# EAGLE design AmplifierPowerSupply (EAGLE 9.4.2)
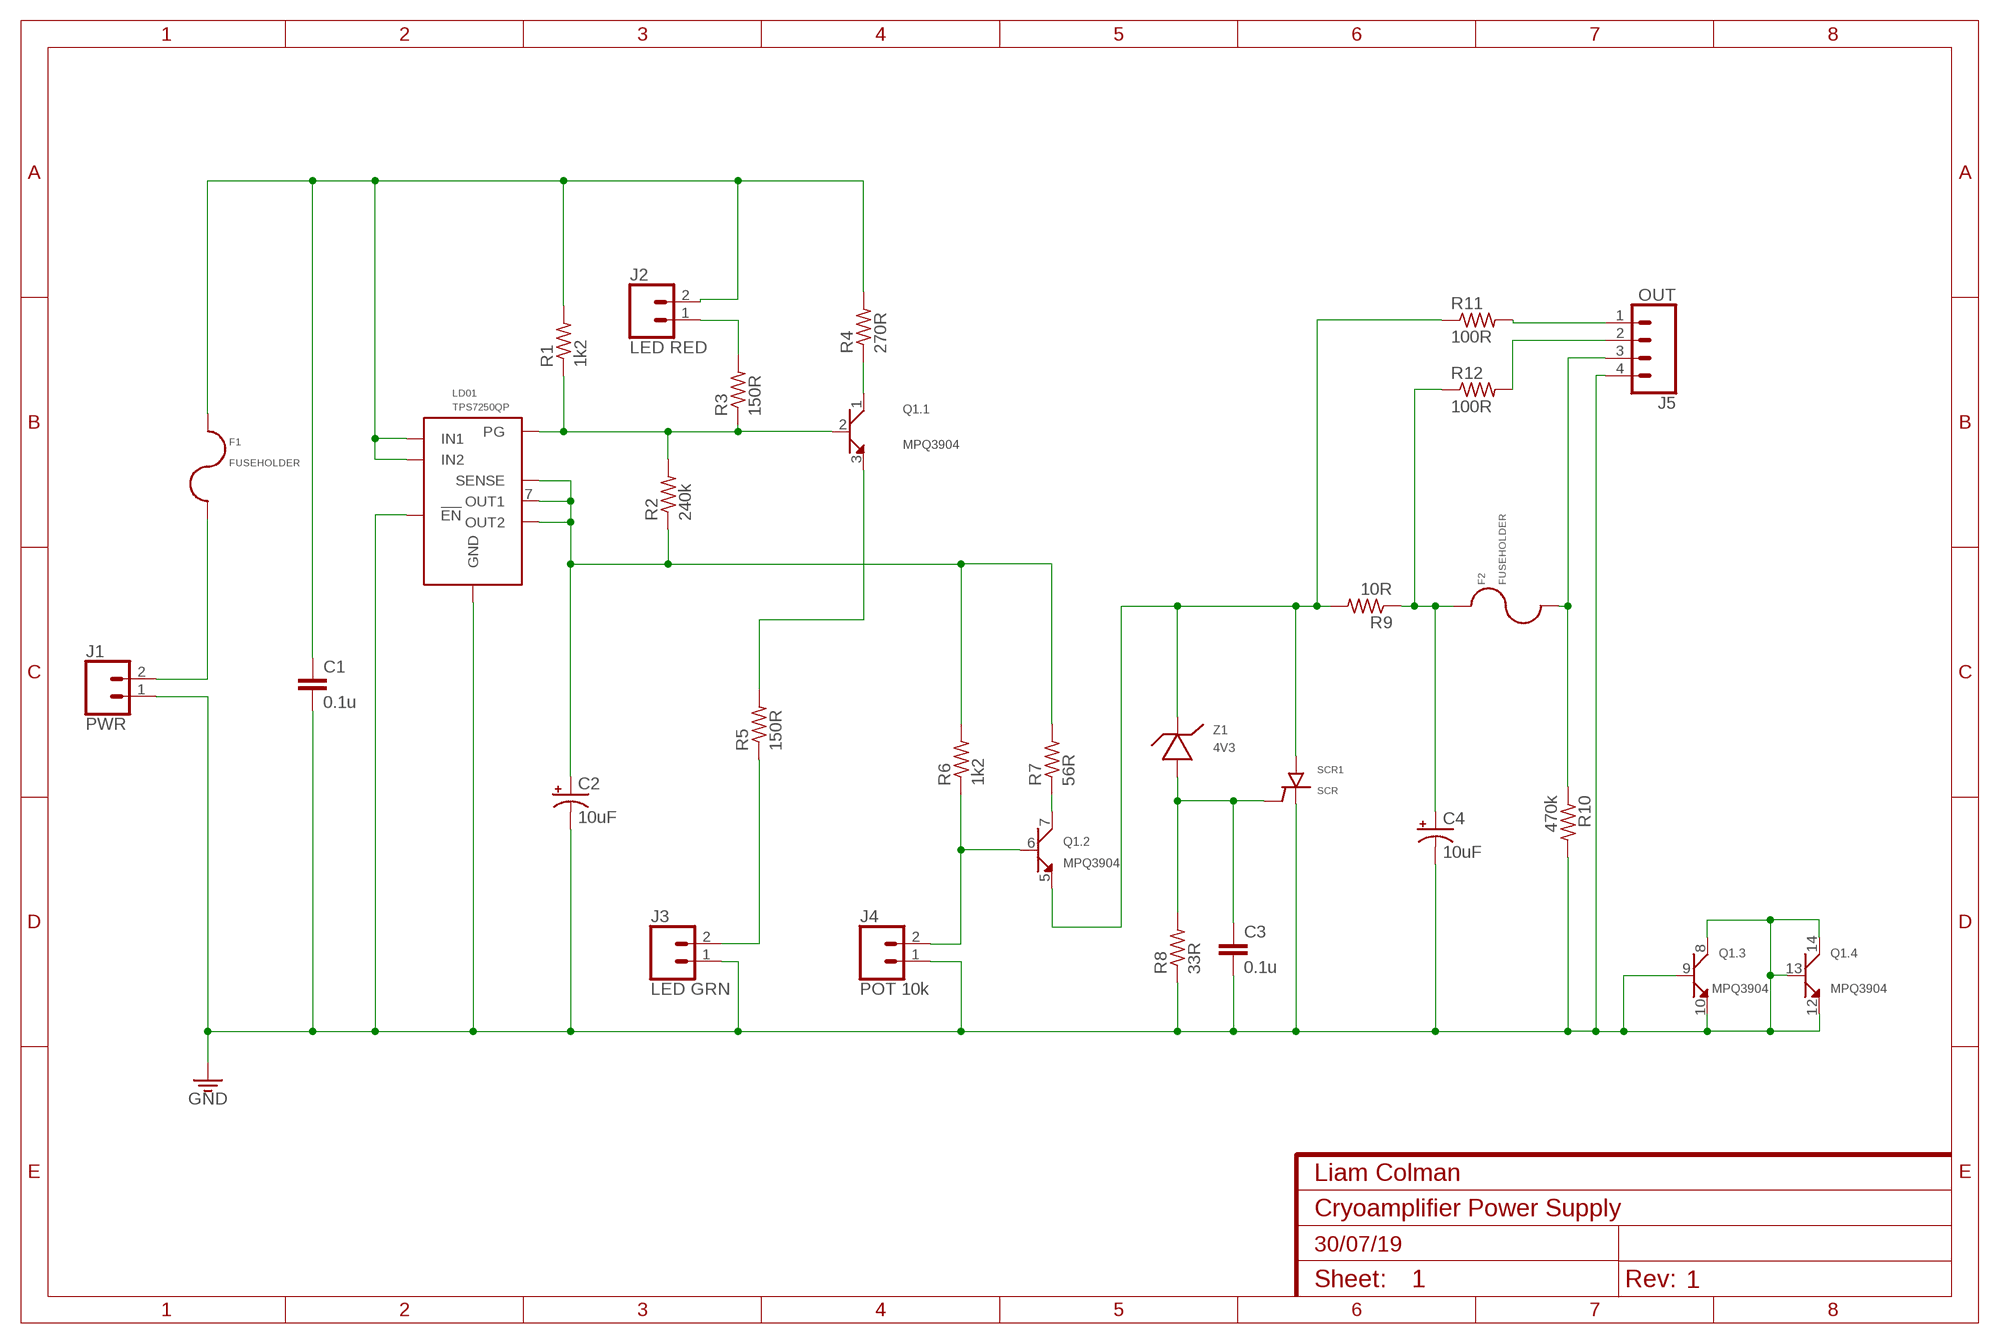
[diagram p0: schematic, sheet 1]

## Parts
C1  0.1u  C-EUC1206K  [C1206K]
C2  10uF  10UF-POLAR-EIA3216-16V-10%(TANT)  [EIA3216]
C3  0.1u  C-EUC1206K  [C1206K]
C4  10uF  10UF-POLAR-EIA3216-16V-10%(TANT)  [EIA3216]
F1  FUSEHOLDER  [FUSEHOLDER]
F2  FUSEHOLDER  [FUSEHOLDER]
FRAME1  FRAMELIAM-A4  [DUMMY]
J1  PWR  CONN_02  [1X02]
J2  LED RED  CONN_02  [1X02]
J3  LED GRN  CONN_02  [1X02]
J4  POT 10k  CONN_02  [1X02]
J5  OUT  CONN_04PTH  [1X04]
LD01  TPS7250QP  LD01  [TPS7250QP]
Q1  MPQ3904  [MPQ3904]
R1  1k2  R-US_R0805  [R0805]
R2  240k  R-US_R0805  [R0805]
R3  150R  R-US_R0805  [R0805]
R4  270R  R-US_R0805  [R0805]
R5  150R  R-US_R0805  [R0805]
R6  1k2  R-US_R0805  [R0805]
R7  56R  R-US_R0805  [R0805]
R8  33R  R-US_R0805  [R0805]
R9  10R  R-US_R0805  [R0805]
R10  470k  R-US_R0805  [R0805]
R11  100R  R-US_R0805  [R0805]
R12  100R  R-US_R0805  [R0805]
SCR1  SCR  [TO-92]
Z1  4V3  ZENERDIODESMD  [DZ2W04300L]

## Nets
GND: C1.2 C2.- C3.2 C4.- J1.1 J3.1 J4.1 J5.4 LD01.3(GND) LD01.4(!EN!) Q1.8(.3:COLLECTOR) Q1.9(.3:BASE) Q1.10(.3:EMITTER) Q1.12(.4:EMITTER) Q1.13(.4:BASE) Q1.14(.4:COLLECTOR) R8.1 R10.2 SCR1.K(CATHODE)
N$1: F1.P$2 J1.2
N$2: C1.1 F1.P$1 J2.2 LD01.5(IN1) LD01.6(IN2) R1.2 R4.2
N$3: J2.1 R3.2
N$4: LD01.2(PG) Q1.2(.1:BASE) R1.1 R2.2 R3.1
N$5: J5.1 R11.2
N$6: J5.2 R12.2
N$7: C4.+ F2.P$1 R9.1 R12.1
N$8: F2.P$2 J5.3 R10.1
N$9: J4.2 Q1.6(.2:BASE) R6.1
N$10: Q1.1(.1:COLLECTOR) R4.1
N$11: Q1.3(.1:EMITTER) R5.2
N$12: J3.2 R5.1
N$13: Q1.7(.2:COLLECTOR) R7.1
N$14: Q1.5(.2:EMITTER) R9.2 R11.1 SCR1.A(ANODE) Z1.1(CATHODE)
N$15: C2.+ LD01.1(SENSE) LD01.7(OUT1) LD01.8(OUT2) R2.1 R6.2 R7.2
N$16: C3.1 R8.2 SCR1.G(GATE) Z1.2(ANODE)

## Library data of the parts
C1 C3 = resistor:C-EU: CAPACITOR, European symbol
C2 C4 = SparkFun-Capacitors:10UF-POLAR: 10.0µF polarized capacitors A capacitor is a passive two-terminal electrical component used to store electrical energy temporarily in an electric field.; PROD_ID: CAP-00811
F1 F2 = RequiredComponents:FUSEHOLDER: Description This is the HTC-100M Fuseholder, which holds a 5x20mm fuse. It is rated at 250V and 5A, and has a pitch of 22.6mm.
FRAME1 = SparkFun-Aesthetics:FRAMELIAM-A4: Schematic Frame - A4L - European Format Standard A4 size frame in Landscape
J1-J4 = SparkFun-Connectors:CONN_02: Multi connection point. Often used as Generic Header-pin footprint for 0.1 inch spaced/style header connections On any of the 0.1 inch spaced packages, you can populate with these: Break Away Headers - Straight <https://www.sparkfun.com/products/116> (PRT-00116) Break Away Male Headers - Right Angle <https://www.sparkfun.com/products/553> (PRT-00553) Female Headers <https://www.sparkfun.com/products/115> (PRT-00115) Break Away Headers - Machine Pin <https://www.sparkfun.com/products/117> (PRT-00117) Break Away Female Headers - Swiss Machine Pin <https://www.sparkfun.com/products/743> (PRT-00743) For SCREWTERMINALS and SPRING TERMINALS visit here: Screw Terimnals on SparkFun.com <https://www.sparkfun.com/search/results?term=Screw+Terminals> (5mm/3.5mm/2.54mm spacing) This device is also useful as a general connection point to wire up your design to another part of your project. Our various solder wires solder well into these plated through hole pads. Hook-Up Wire - Assortment (Stranded, 22 AWG) <https://www.sparkfun.com/products/11375> (PRT-11375) Hook-Up Wire - Assortment (Solid Core, 22 AWG) <https://www.sparkfun.com/products/11367> (PRT-11367) View the entire wire category on our website here <https://www.sparkfun.com/categories/141> Special notes: Molex polarized connector foot print use with: PRT-08233 with associated crimp pins and housings. 2.54_SCREWTERM for use with PRT-10571. 3.5mm Screw Terminal footprints for PRT-08084 5mm Screw Terminal footprints for use with PRT-08432
J5 = SparkFun-Connectors:CONN_04: Multi connection point. Often used as Generic Header-pin footprint for 0.1 inch spaced/style header connections On any of the 0.1 inch spaced packages, you can populate with these: Break Away Headers - Straight <https://www.sparkfun.com/products/116> (PRT-00116) Break Away Male Headers - Right Angle <https://www.sparkfun.com/products/553> (PRT-00553) Female Headers <https://www.sparkfun.com/products/115> (PRT-00115) Break Away Headers - Machine Pin <https://www.sparkfun.com/products/117> (PRT-00117) Break Away Female Headers - Swiss Machine Pin <https://www.sparkfun.com/products/743> (PRT-00743) For SCREWTERMINALS and SPRING TERMINALS visit here: Screw Terimnals on SparkFun.com <https://www.sparkfun.com/search/results?term=Screw+Terminals> (5mm/3.5mm/2.54mm spacing) This device is also useful as a general connection point to wire up your design to another part of your project. Our various solder wires solder well into these plated through hole pads. Hook-Up Wire - Assortment (Stranded, 22 AWG) <https://www.sparkfun.com/products/11375> (PRT-11375) Hook-Up Wire - Assortment (Solid Core, 22 AWG) <https://www.sparkfun.com/products/11367> (PRT-11367) View the entire wire category on our website here <https://www.sparkfun.com/categories/141> Special notes: Molex polarized connector foot print use with SKU : PRT-08231 with associated crimp pins and housings. 1MM SMD Version SKU: PRT-10208; PROD_ID: CONN-09696
LD01 = RequiredComponents:LD01: Description This is a micro power low-dropout voltage regulator, which also has a power-good output, and extremely low quiescent currents.
Q1 = RequiredComponents:MPQ3904: Description This is a quad polar transistor configuration inside of a TO-116 package.
R1-R12 = resistor:R-US_: RESISTOR, American symbol
SCR1 = RequiredComponents:SCR: Description This is a sensitive gate SCR, which will short itself if the voltage in the circuit exceeds a certain value. Useful for circuit protection
Z1 = RequiredComponents:ZENERDIODE

## Board
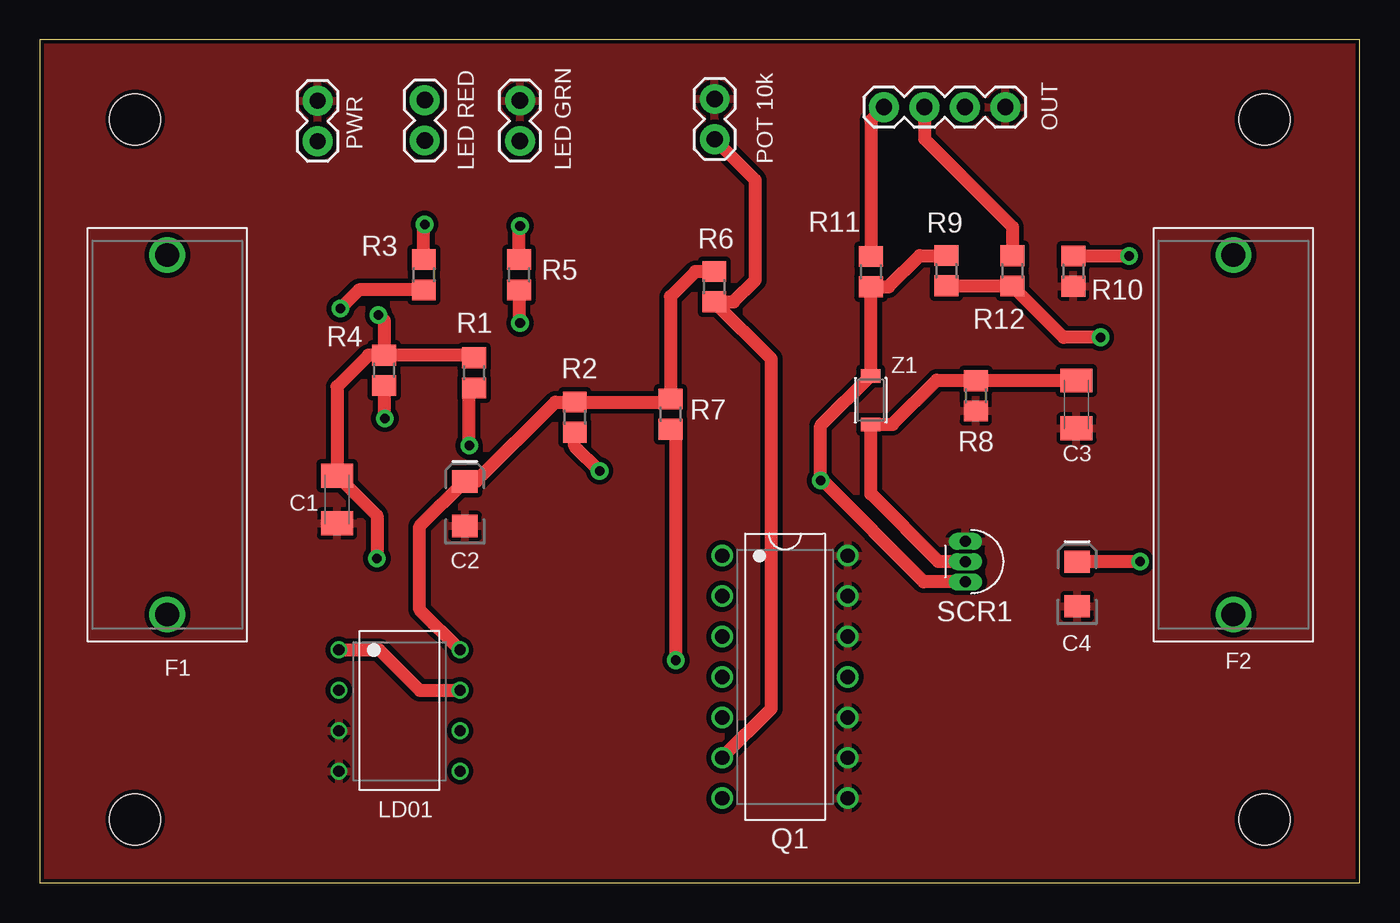
[diagram p1: board, top side]
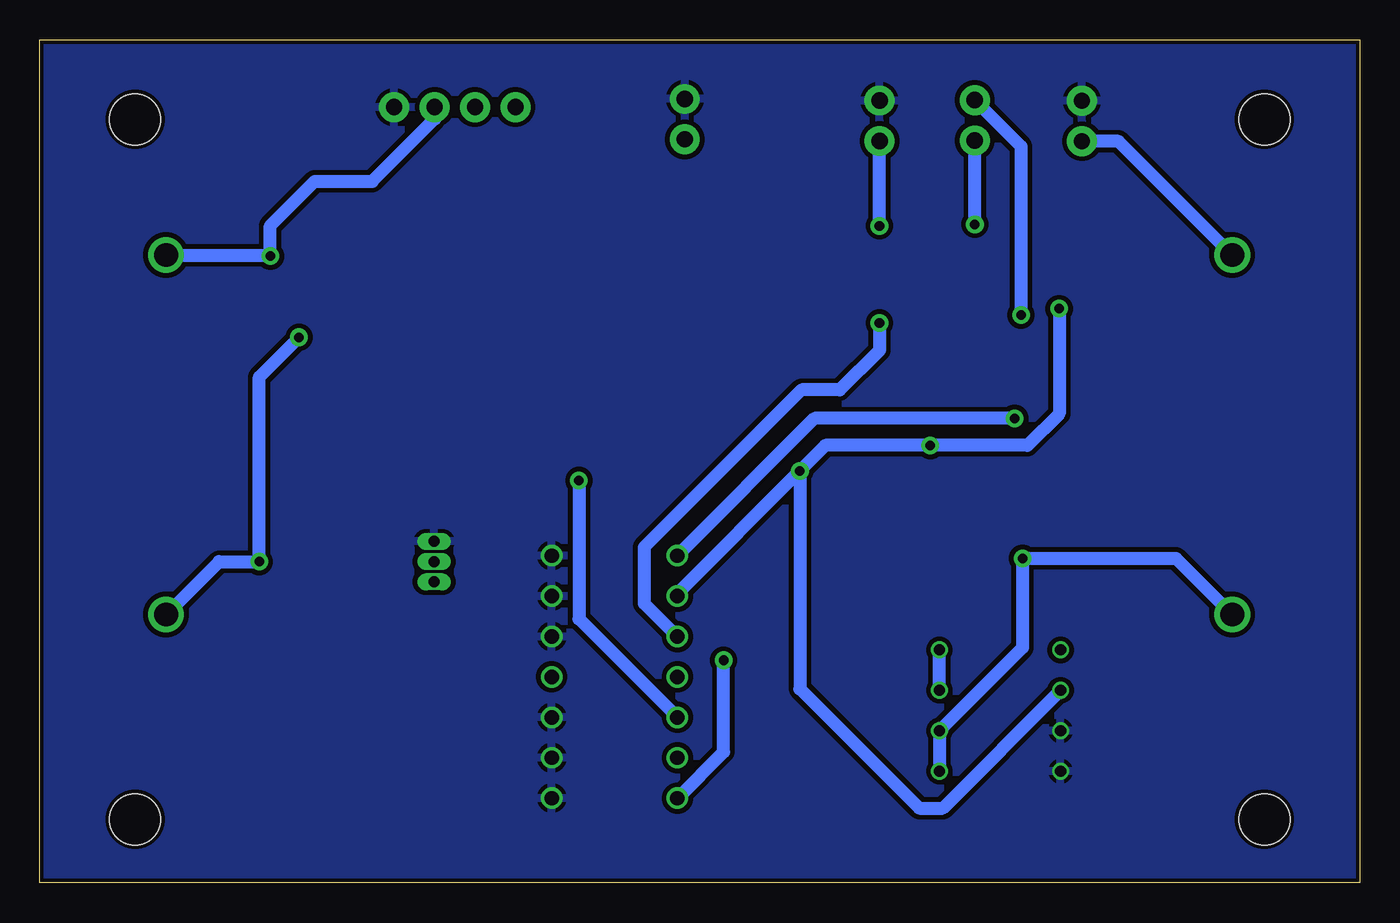
[diagram p2: board, bottom side, seen from below]

Size 83 x 53 mm. Coordinates in mm from the lower left corner, seen from the top.
Outline: 0,0 83,0 83,53 0,53 0,0
Copper layers (1*16): Top 0.035mm / dielectric 1.5mm / Bottom 0.035mm
Design rules "PCBTrain *": minimum track width 8mil, minimum drill 0.2mm, track to track 0.3mm, track to pad 0.3mm, pad to pad 8mil, via to via 8mil, smd to smd 8mil, copper to edge 0.25mm, drill to drill 8mil, minimum pad ring 7mil, minimum via ring 10mil, stop-mask expansion 4mil, vias tented up to drill 20mil, thermal gap 10mil
Holes 3.2 mm at 6,48 77,48 6,4 77,4

### Footprints (pad centres in the part's own frame; a part is rotated, then mirrored left to right if it is on the bottom)
C1206K = smd 1.5 x 2: 1 -1.5,0; 2 1.5,0
EIA3216 = smd 1.4 x 1.6: + 1.4,0; - -1.4,0
FUSEHOLDER = drill 1.5: P$1 11.3,0; P$2 -11.3,0
1X02 = drill 1.016 pad 1.88: 1 0,0; 2 2.54,0
1X04 = drill 1.016 pad 1.88: 1 0,0; 2 2.54,0; 3 5.08,0; 4 7.62,0
TPS7250QP = drill 0.7: 1 -3.81,-3.81; 2 -1.27,-3.81; 3 1.27,-3.81; 4 3.81,-3.81; 5 3.81,3.81; 6 1.27,3.81; 7 -1.27,3.81; 8 -3.81,3.81
MPQ3904 = drill 0.9: 1 -7.62,-3.95; 2 -5.08,-3.95; 3 -2.54,-3.95; 4 0,-3.95; 5 2.54,-3.95; 6 5.08,-3.95; 7 7.62,-3.95; 8 7.62,3.95; 9 5.08,3.95; 10 2.54,3.95; 11 0,3.95; 12 -2.54,3.95; 13 -5.08,3.95; 14 -7.62,3.95
R0805 = smd 1.3 x 1.5: 1 -0.95,0; 2 0.95,0
TO-92 = drill 0.7 pad 0.85 long: A 1.27,0; G 0,0; K -1.27,0
DZ2W04300L = smd 0.85 x 1.2: 1 -1.525,0; 2 1.525,0

### Placement (x,y rotation side)
C1  18.69,24.1 270 top
C2  26.73,23.84 90 top
C3  65.19,30.08 270 top
C4  65.23,18.79 90 top
F1  8.02,28.17 270 top
F2  75.06,28.17 270 top
FRAME1  -52.07,64.77 0 top  (outside the outline)
J1  17.47,49.16 270 top
J2  24.21,46.67 90 top
J3  30.19,49.18 270 top
J4  42.44,49.28 270 top
J5  53.09,48.77 0 top
LD01  22.62,10.84 270 top
Q1  46.86,12.95 270 top
R1  27.31,32.06 90 top
R2  33.64,29.28 270 top
R3  24.15,38.23 90 top
R4  21.66,32.22 90 top
R5  30.14,38.23 270 top
R6  42.41,37.48 90 top
R7  39.66,29.47 90 top
R8  58.86,30.62 90 top
R9  57.01,38.49 90 top
R10  64.99,38.46 270 top
R11  52.26,38.42 90 top
R12  61.16,38.47 90 top
SCR1  58.2,20.2 270 top
Z1  52.25,30.35 270 top

### Tracks (layer width: path | path; a pad name or v marks a point on that pad's centre or on a via)
GND
  pour Top: 0,53 83,53 83,0 0,0
  pour Bottom: 0,53 83,53 83,0 0,0
N$1
  Bottom 0.813: F1.P$2 15.17,46.62 J1.2
N$2  (via drill 0.6)
  Top 0.813: v21.3,35.7 21.66,35.34 R4.2 | R1.2 27.15,33.17 R4.2 | R4.2 20.67,33.17 18.69,31.19 C1.1 21.2,23.09 v21.2,20.4
  Bottom 0.813: J2.2 21.3,46.3 v21.3,35.7 | F1.P$1 11.55,20.4 v21.2,20.4 21.2,14.8 LD01.6 LD01.5
N$3  (via drill 0.6)
  Top 0.813: R3.2 24.15,41.35 v24.2,41.4
  Bottom 0.813: v24.2,41.4 J2.1
N$4  (via drill 0.6)
  Top 0.813: R3.1 20.08,37.28 v18.9,36.1 | v27,27.5 27,30.8 R1.1 | v35.2,25.9 33.64,27.46 R2.2
  Bottom 0.813: v18.9,36.1 18.9,29.5 20.9,27.5 v27,27.5 33.6,27.5 v35.2,25.9 | v35.2,25.9 42.91,18.19 Q1.2 | v35.2,25.9 35.2,12.2 27.7,4.7 26.22,4.7 LD01.2
N$5
  Top 0.813: J5.1 52.26,47.94 R11.2
N$6
  Top 0.813: J5.2 55.63,46.77 61.16,41.24 R12.2
N$7  (via drill 0.6)
  Top 0.813: v69.2,20.2 C4.+ | R9.1 61.14,37.54 R12.1 64.38,34.3 v66.7,34.3
  Bottom 0.813: F2.P$1 71.73,20.2 v69.2,20.2 69.2,31.8 v66.7,34.3
N$8  (via drill 0.6)
  Top 0.813: v68.5,39.4 R10.1
  Bottom 0.813: F2.P$2 68.57,39.47 v68.5,39.4 68.5,41.3 65.7,44.1 62.1,44.1 58.17,48.03 J5.3
N$9
  Top 0.813: Q1.6 46,10.96 46,32.94 R6.1 43.63,36.53 45,37.9 45,44.18 J4.2
N$10  (via drill 0.6)
  Top 0.813: R4.1 21.66,29.24 v21.7,29.2
  Bottom 0.813: v21.7,29.2 34.28,29.2 Q1.1
N$11  (via drill 0.6)
  Top 0.813: R5.2 30.14,35.26 v30.2,35.2
  Bottom 0.813: v30.2,35.2 30.2,33.5 32.7,31 35.1,31 45,21.1 45,17.58 Q1.3
N$12  (via drill 0.6)
  Top 0.813: R5.1 30.14,41.24 v30.2,41.3
  Bottom 0.813: v30.2,41.3 J3.2
N$13  (via drill 0.6)
  Top 0.813: v40,14 40,28.18 R7.1
  Bottom 0.813: Q1.7 40,8.24 v40,14
N$14  (via drill 0.6)
  Top 0.813: R9.2 55.34,39.44 53.37,37.47 R11.1 Z1.1 49.1,28.73 v49.1,25.3 49.2,25.3 55.57,18.93 SCR1.A
  Bottom 0.813: v49.1,25.3 49.1,16.6 Q1.5
N$15
  Top 0.813: R6.2 41.23,38.43 39.66,36.86 R7.2 39.47,30.23 R2.1 32.43,30.23 27.44,25.24 C2.+ 23.9,22.41 23.9,17.18 LD01.8 | LD01.1 21.35,14.65 23.9,12.1 LD01.7
  Bottom 0.813: LD01.7 LD01.8
N$16
  Top 0.813: C3.1 R8.2 58.83,31.6 56.4,31.6 53.62,28.82 Z1.2 52.25,24.45 56.5,20.2 SCR1.G

### Text on the board
tPlace: OUT | PWR | LED RED | LED GRN | POT 10k